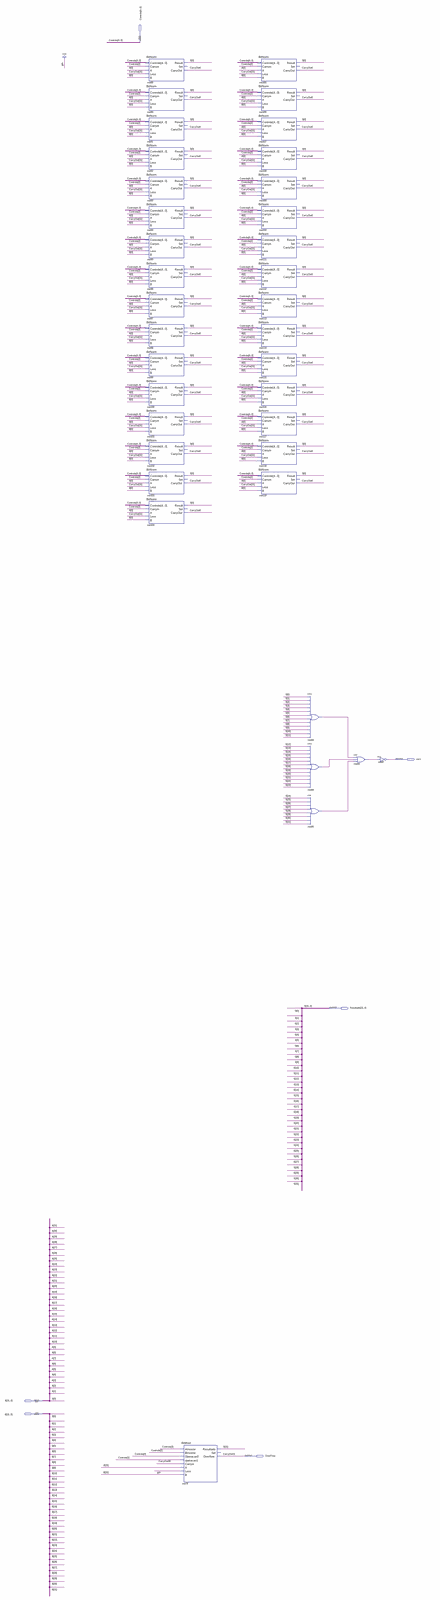
[diagram p0: schematic sheet, whole]
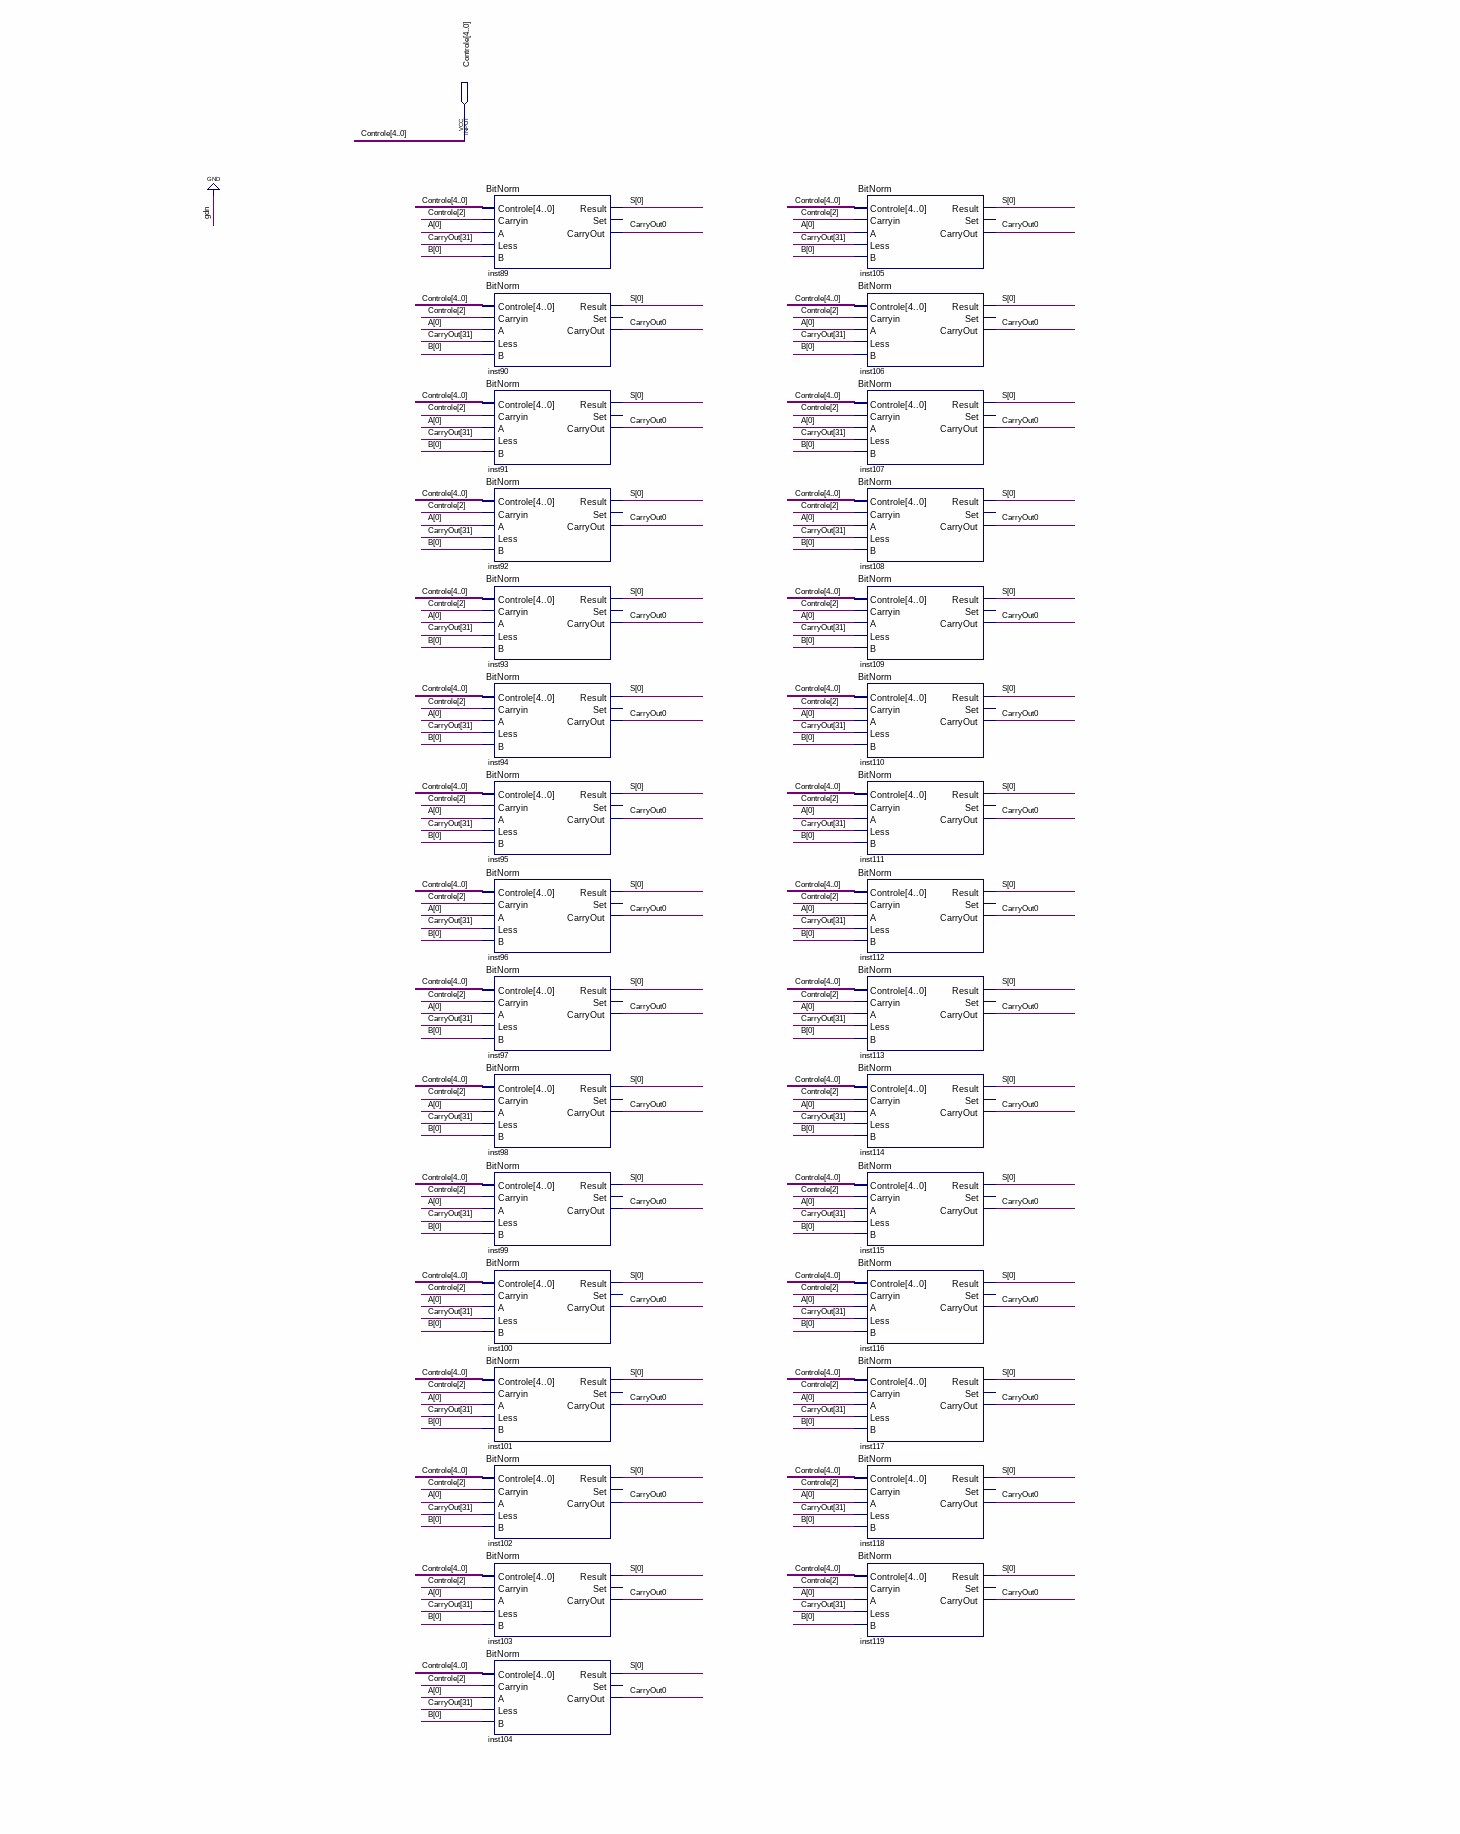
[diagram p1: schematic sheet, upper part]
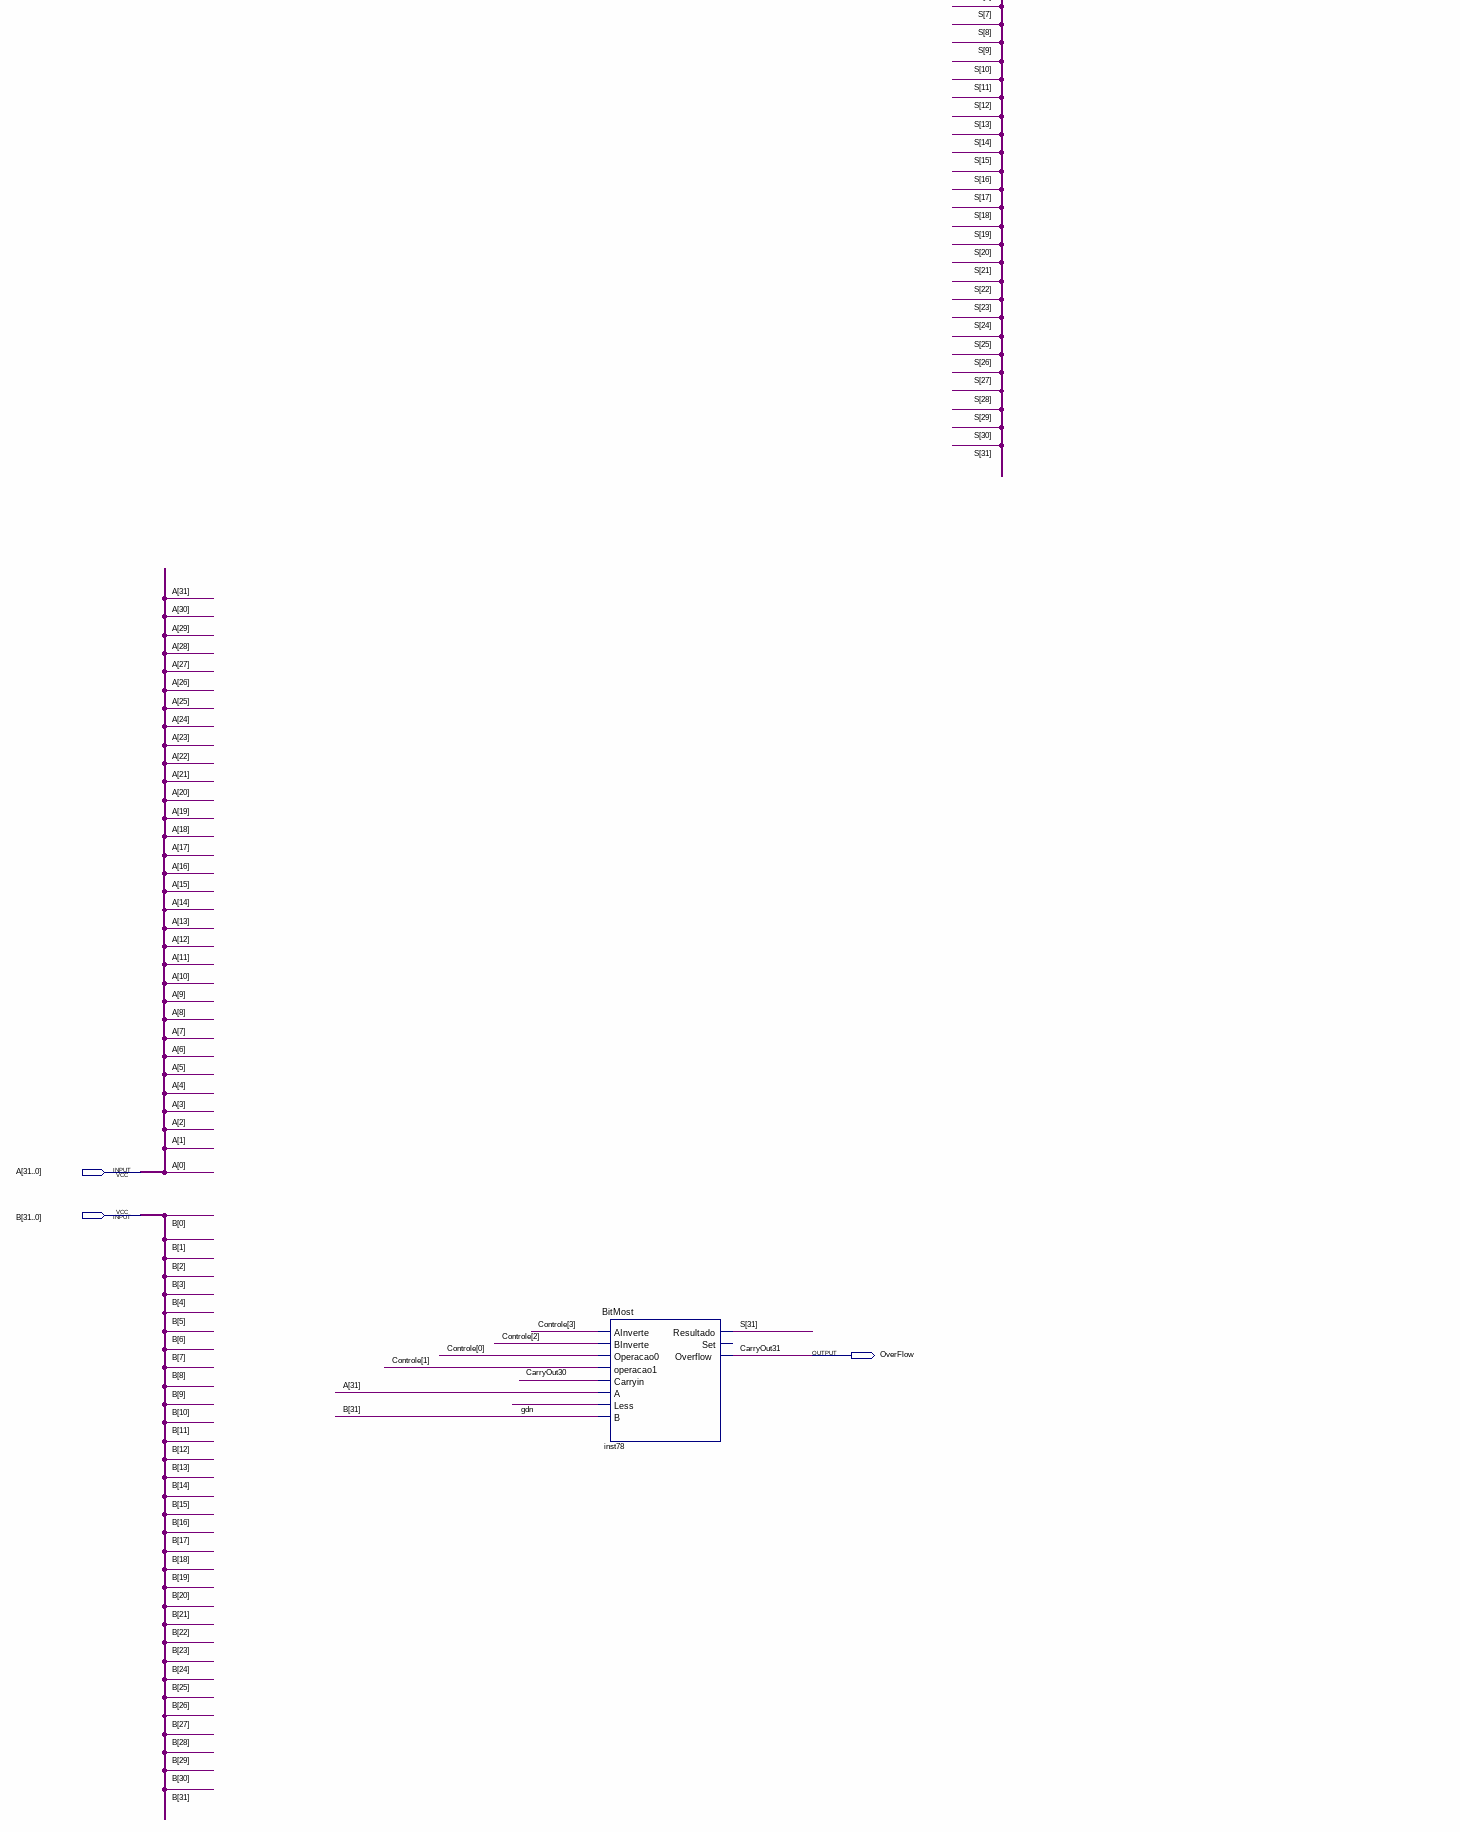
[diagram p2: schematic sheet, lower part]
// Quartus schematic UlaPrincipal.bdf as structural Verilog: 37 symbols, 6 pins
module UlaPrincipal (
  input  [4:0] Controle,
  input  [31:0] A,
  input  [31:0] B,
  output zero,
  output [31:0] Resultado,
  output OverFlow
);

  wire CarryOut0, CarryOut30, inst83_out, inst84_out, inst85_out, inst86_out;

  BitNorm inst89 (
    .Controle(Controle), .Carryin(Controle[2]), .A(A[0]), .Less(OverFlow), .B(B[0]), .Result(Resultado[0]),
    .CarryOut(CarryOut0));  // open: Set
  BitNorm inst90 (
    .Controle(Controle), .Carryin(Controle[2]), .A(A[0]), .Less(OverFlow), .B(B[0]), .Result(Resultado[0]),
    .CarryOut(CarryOut0));  // open: Set
  BitNorm inst91 (
    .Controle(Controle), .Carryin(Controle[2]), .A(A[0]), .Less(OverFlow), .B(B[0]), .Result(Resultado[0]),
    .CarryOut(CarryOut0));  // open: Set
  BitNorm inst92 (
    .Controle(Controle), .Carryin(Controle[2]), .A(A[0]), .Less(OverFlow), .B(B[0]), .Result(Resultado[0]),
    .CarryOut(CarryOut0));  // open: Set
  BitNorm inst93 (
    .Controle(Controle), .Carryin(Controle[2]), .A(A[0]), .Less(OverFlow), .B(B[0]), .Result(Resultado[0]),
    .CarryOut(CarryOut0));  // open: Set
  BitNorm inst94 (
    .Controle(Controle), .Carryin(Controle[2]), .A(A[0]), .Less(OverFlow), .B(B[0]), .Result(Resultado[0]),
    .CarryOut(CarryOut0));  // open: Set
  BitNorm inst95 (
    .Controle(Controle), .Carryin(Controle[2]), .A(A[0]), .Less(OverFlow), .B(B[0]), .Result(Resultado[0]),
    .CarryOut(CarryOut0));  // open: Set
  BitNorm inst96 (
    .Controle(Controle), .Carryin(Controle[2]), .A(A[0]), .Less(OverFlow), .B(B[0]), .Result(Resultado[0]),
    .CarryOut(CarryOut0));  // open: Set
  BitNorm inst97 (
    .Controle(Controle), .Carryin(Controle[2]), .A(A[0]), .Less(OverFlow), .B(B[0]), .Result(Resultado[0]),
    .CarryOut(CarryOut0));  // open: Set
  BitNorm inst98 (
    .Controle(Controle), .Carryin(Controle[2]), .A(A[0]), .Less(OverFlow), .B(B[0]), .Result(Resultado[0]),
    .CarryOut(CarryOut0));  // open: Set
  BitNorm inst99 (
    .Controle(Controle), .Carryin(Controle[2]), .A(A[0]), .Less(OverFlow), .B(B[0]), .Result(Resultado[0]),
    .CarryOut(CarryOut0));  // open: Set
  BitNorm inst100 (
    .Controle(Controle), .Carryin(Controle[2]), .A(A[0]), .Less(OverFlow), .B(B[0]), .Result(Resultado[0]),
    .CarryOut(CarryOut0));  // open: Set
  BitNorm inst101 (
    .Controle(Controle), .Carryin(Controle[2]), .A(A[0]), .Less(OverFlow), .B(B[0]), .Result(Resultado[0]),
    .CarryOut(CarryOut0));  // open: Set
  BitNorm inst102 (
    .Controle(Controle), .Carryin(Controle[2]), .A(A[0]), .Less(OverFlow), .B(B[0]), .Result(Resultado[0]),
    .CarryOut(CarryOut0));  // open: Set
  BitNorm inst103 (
    .Controle(Controle), .Carryin(Controle[2]), .A(A[0]), .Less(OverFlow), .B(B[0]), .Result(Resultado[0]),
    .CarryOut(CarryOut0));  // open: Set
  BitNorm inst104 (
    .Controle(Controle), .Carryin(Controle[2]), .A(A[0]), .Less(OverFlow), .B(B[0]), .Result(Resultado[0]),
    .CarryOut(CarryOut0));  // open: Set
  BitMost inst78 (
    .AInverte(Controle[3]), .BInverte(Controle[2]), .Operacao0(Controle[0]), .operacao1(Controle[1]),
    .Carryin(CarryOut30), .A(A[31]), .Less(1'b0), .B(B[31]), .Resultado(Resultado[31]), .Overflow(OverFlow));  // open: Set
  BitNorm inst105 (
    .Controle(Controle), .Carryin(Controle[2]), .A(A[0]), .Less(OverFlow), .B(B[0]), .Result(Resultado[0]),
    .CarryOut(CarryOut0));  // open: Set
  BitNorm inst106 (
    .Controle(Controle), .Carryin(Controle[2]), .A(A[0]), .Less(OverFlow), .B(B[0]), .Result(Resultado[0]),
    .CarryOut(CarryOut0));  // open: Set
  BitNorm inst107 (
    .Controle(Controle), .Carryin(Controle[2]), .A(A[0]), .Less(OverFlow), .B(B[0]), .Result(Resultado[0]),
    .CarryOut(CarryOut0));  // open: Set
  BitNorm inst108 (
    .Controle(Controle), .Carryin(Controle[2]), .A(A[0]), .Less(OverFlow), .B(B[0]), .Result(Resultado[0]),
    .CarryOut(CarryOut0));  // open: Set
  BitNorm inst109 (
    .Controle(Controle), .Carryin(Controle[2]), .A(A[0]), .Less(OverFlow), .B(B[0]), .Result(Resultado[0]),
    .CarryOut(CarryOut0));  // open: Set
  BitNorm inst110 (
    .Controle(Controle), .Carryin(Controle[2]), .A(A[0]), .Less(OverFlow), .B(B[0]), .Result(Resultado[0]),
    .CarryOut(CarryOut0));  // open: Set
  BitNorm inst111 (
    .Controle(Controle), .Carryin(Controle[2]), .A(A[0]), .Less(OverFlow), .B(B[0]), .Result(Resultado[0]),
    .CarryOut(CarryOut0));  // open: Set
  BitNorm inst112 (
    .Controle(Controle), .Carryin(Controle[2]), .A(A[0]), .Less(OverFlow), .B(B[0]), .Result(Resultado[0]),
    .CarryOut(CarryOut0));  // open: Set
  BitNorm inst113 (
    .Controle(Controle), .Carryin(Controle[2]), .A(A[0]), .Less(OverFlow), .B(B[0]), .Result(Resultado[0]),
    .CarryOut(CarryOut0));  // open: Set
  BitNorm inst114 (
    .Controle(Controle), .Carryin(Controle[2]), .A(A[0]), .Less(OverFlow), .B(B[0]), .Result(Resultado[0]),
    .CarryOut(CarryOut0));  // open: Set
  BitNorm inst115 (
    .Controle(Controle), .Carryin(Controle[2]), .A(A[0]), .Less(OverFlow), .B(B[0]), .Result(Resultado[0]),
    .CarryOut(CarryOut0));  // open: Set
  BitNorm inst116 (
    .Controle(Controle), .Carryin(Controle[2]), .A(A[0]), .Less(OverFlow), .B(B[0]), .Result(Resultado[0]),
    .CarryOut(CarryOut0));  // open: Set
  BitNorm inst117 (
    .Controle(Controle), .Carryin(Controle[2]), .A(A[0]), .Less(OverFlow), .B(B[0]), .Result(Resultado[0]),
    .CarryOut(CarryOut0));  // open: Set
  BitNorm inst118 (
    .Controle(Controle), .Carryin(Controle[2]), .A(A[0]), .Less(OverFlow), .B(B[0]), .Result(Resultado[0]),
    .CarryOut(CarryOut0));  // open: Set
  BitNorm inst119 (
    .Controle(Controle), .Carryin(Controle[2]), .A(A[0]), .Less(OverFlow), .B(B[0]), .Result(Resultado[0]),
    .CarryOut(CarryOut0));  // open: Set
  or inst83 (inst83_out, Resultado[0], Resultado[1], Resultado[2], Resultado[3], Resultado[4], Resultado[5], Resultado[6], Resultado[7], Resultado[8], Resultado[9], Resultado[10], Resultado[11]);
  or inst84 (inst84_out, Resultado[12], Resultado[13], Resultado[14], Resultado[15], Resultado[16], Resultado[17], Resultado[18], Resultado[19], Resultado[20], Resultado[21], Resultado[22], Resultado[23]);
  or inst85 (inst85_out, Resultado[24], Resultado[25], Resultado[26], Resultado[27], Resultado[28], Resultado[29], Resultado[30], Resultado[31]);
  or inst86 (inst86_out, inst83_out, inst84_out, inst85_out);
  not inst87 (zero, inst86_out);

  // Other names for the same wires on the sheet: CarryOut[31] = OverFlow; CarryOut31 = OverFlow; S[31:0] = Resultado
endmodule
